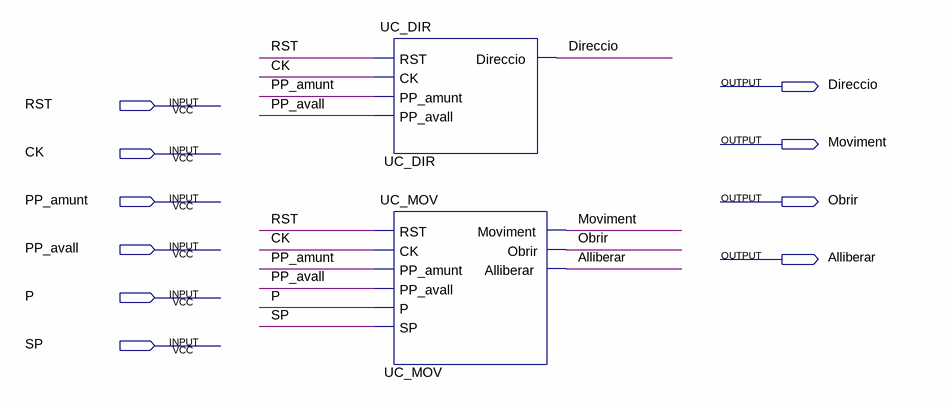
[diagram p0: schematic sheet]
// Quartus schematic UC.bdf as structural Verilog: 2 symbols, 10 pins
module UC (
  input  RST,
  input  CK,
  input  PP_amunt,
  input  PP_avall,
  input  P,
  input  SP,
  output Direccio,
  output Moviment,
  output Obrir,
  output Alliberar
);

  UC_DIR UC_DIR (.RST(RST), .CK(CK), .PP_amunt(PP_amunt), .PP_avall(PP_avall), .Direccio(Direccio));
  UC_MOV UC_MOV (
    .RST(RST), .CK(CK), .PP_amunt(PP_amunt), .PP_avall(PP_avall), .P(P), .SP(SP), .Moviment(Moviment),
    .Obrir(Obrir), .Alliberar(Alliberar));
endmodule
